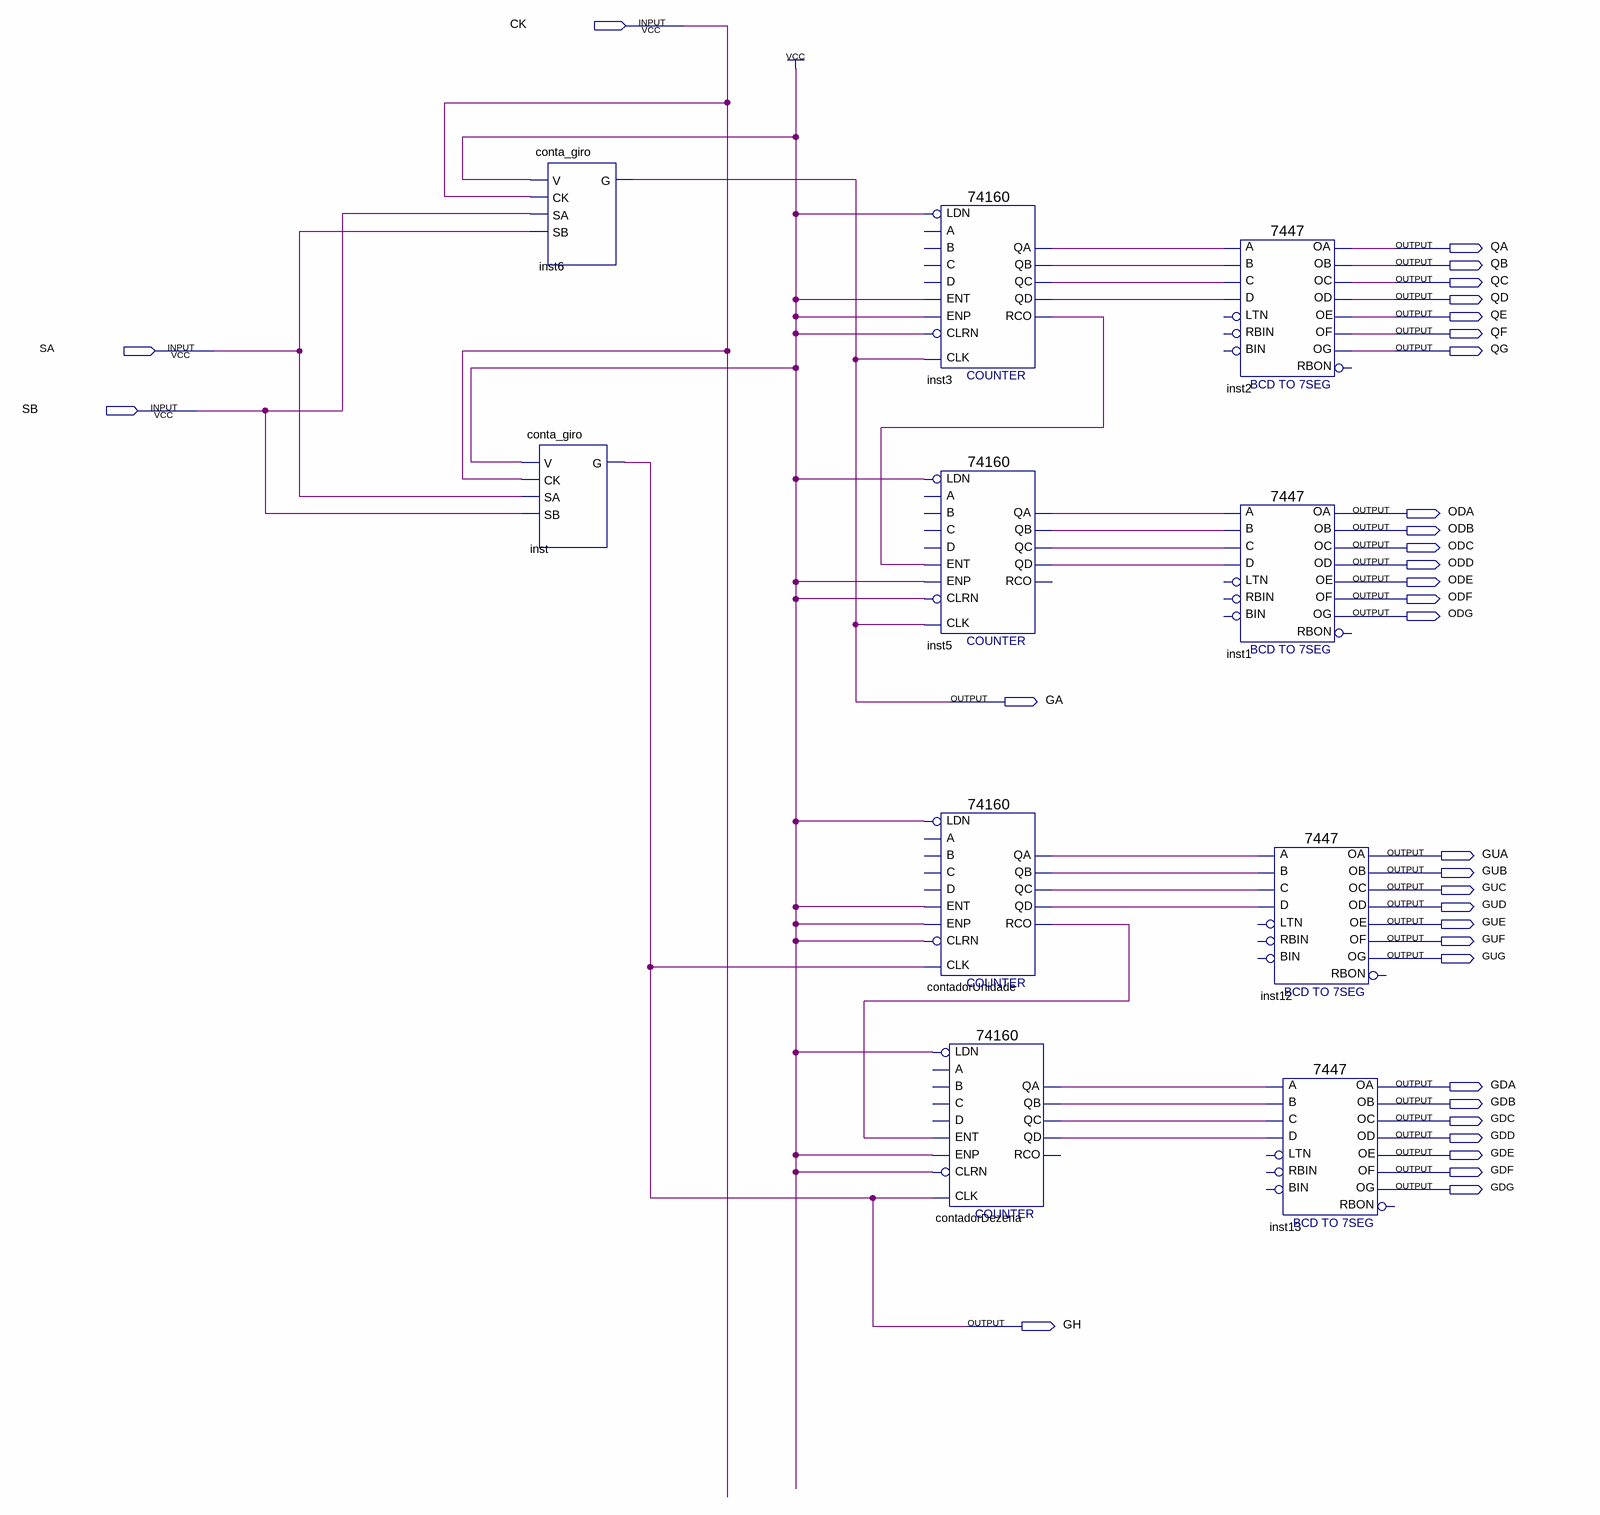
[diagram p0: schematic sheet]
// Quartus schematic catraca.bdf as structural Verilog: 10 symbols, 33 pins
module catraca (
  input  CK,
  input  SA,
  input  SB,
  output QA,
  output QB,
  output QC,
  output QD,
  output QE,
  output QF,
  output QG,
  output ODA,
  output ODB,
  output ODC,
  output ODD,
  output ODE,
  output ODF,
  output ODG,
  output GA,
  output GUA,
  output GUB,
  output GUC,
  output GUD,
  output GUE,
  output GUF,
  output GUG,
  output GDA,
  output GDB,
  output GDC,
  output GDD,
  output GDE,
  output GDF,
  output GDG,
  output GH
);

  wire contadorDezena_qa, contadorDezena_qb, contadorDezena_qc, contadorDezena_qd, contadorUnidade_qa,
       contadorUnidade_qb, contadorUnidade_qc, contadorUnidade_qd, contadorUnidade_rco, inst3_qa, inst3_qb,
       inst3_qc, inst3_qd, inst3_rco, inst5_qa, inst5_qb, inst5_qc, inst5_qd;

  conta_giro inst6 (.V(1'b1), .CK(CK), .SA(SB), .SB(SA), .G(GA));
  conta_giro inst (.V(1'b1), .CK(CK), .SA(SA), .SB(SB), .G(GH));
  \74160  inst3 (
    .CLK(GA), .ENT(1'b1), .LDN(1'b1), .ENP(1'b1), .CLRN(1'b1), .QD(inst3_qd), .QA(inst3_qa), .QB(inst3_qb),
    .QC(inst3_qc), .RCO(inst3_rco));  // open: A, B, C, D
  \74160  inst5 (
    .CLK(GA), .ENT(inst3_rco), .LDN(1'b1), .ENP(1'b1), .CLRN(1'b1), .QD(inst5_qd), .QA(inst5_qa),
    .QB(inst5_qb), .QC(inst5_qc));  // open: A, B, C, D, RCO
  \74160  contadorUnidade (
    .CLK(GH), .ENT(1'b1), .LDN(1'b1), .ENP(1'b1), .CLRN(1'b1), .QD(contadorUnidade_qd),
    .QA(contadorUnidade_qa), .QB(contadorUnidade_qb), .QC(contadorUnidade_qc), .RCO(contadorUnidade_rco));  // open: A, B, C, D
  \74160  contadorDezena (
    .CLK(GH), .ENT(contadorUnidade_rco), .LDN(1'b1), .ENP(1'b1), .CLRN(1'b1), .QD(contadorDezena_qd),
    .QA(contadorDezena_qa), .QB(contadorDezena_qb), .QC(contadorDezena_qc));  // open: A, B, C, D, RCO
  \7447  inst2 (
    .B(inst3_qb), .C(inst3_qc), .D(inst3_qd), .A(inst3_qa), .OB(QB), .OC(QC), .OE(QE), .OD(QD), .OF(QF),
    .OG(QG), .OA(QA));  // open: LTN, RBIN, BIN, RBON
  \7447  inst1 (
    .B(inst5_qb), .C(inst5_qc), .D(inst5_qd), .A(inst5_qa), .OB(ODB), .OC(ODC), .OE(ODE), .OD(ODD), .OF(ODF),
    .OG(ODG), .OA(ODA));  // open: LTN, RBIN, BIN, RBON
  \7447  inst12 (
    .B(contadorUnidade_qb), .C(contadorUnidade_qc), .D(contadorUnidade_qd), .A(contadorUnidade_qa), .OB(GUB),
    .OC(GUC), .OE(GUE), .OD(GUD), .OF(GUF), .OG(GUG), .OA(GUA));  // open: LTN, RBIN, BIN, RBON
  \7447  inst13 (
    .B(contadorDezena_qb), .C(contadorDezena_qc), .D(contadorDezena_qd), .A(contadorDezena_qa), .OB(GDB),
    .OC(GDC), .OE(GDE), .OD(GDD), .OF(GDF), .OG(GDG), .OA(GDA));  // open: LTN, RBIN, BIN, RBON
endmodule
